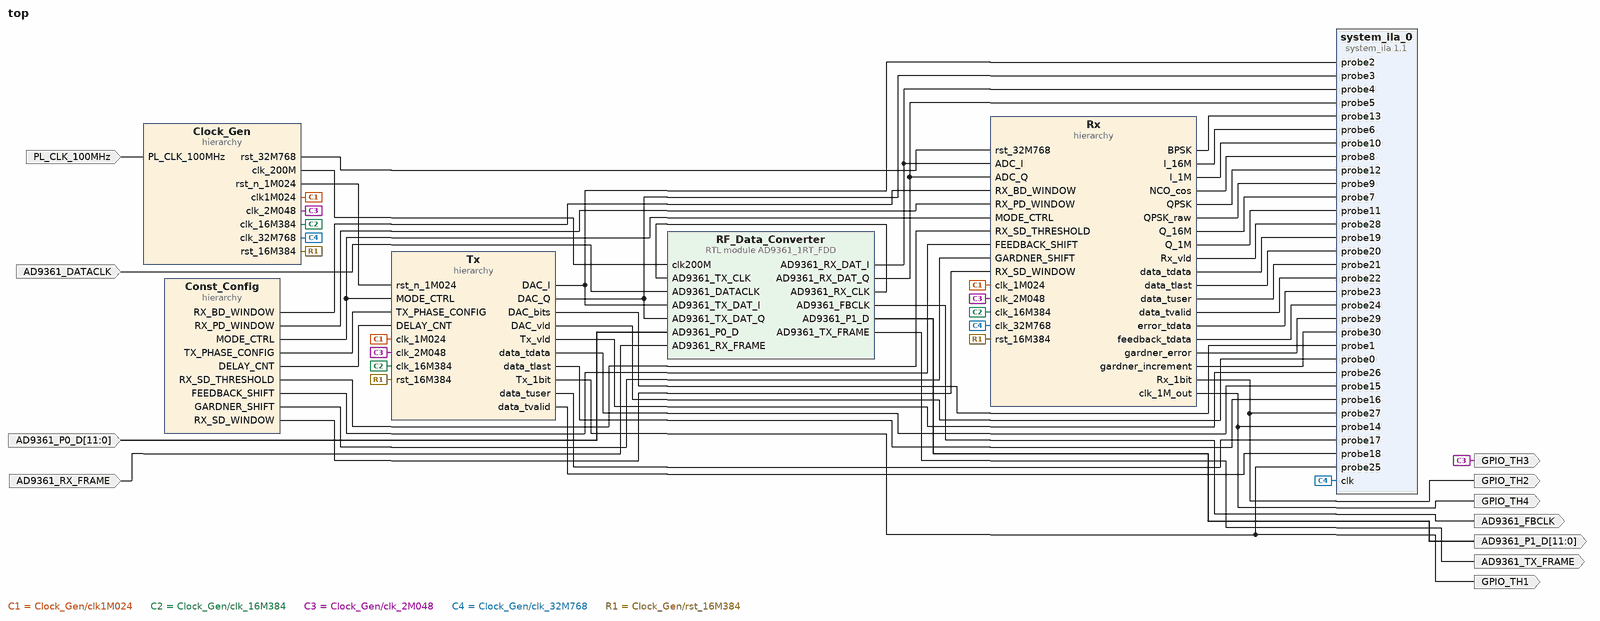
[diagram p0: block diagram of the top level]
# Vivado block design top, xc7z020clg484-1, Vivado 2022.2
create_bd_design top

create_bd_port -dir I -type clk PL_CLK_100MHz
set_property -dict {CONFIG.FREQ_HZ 100000000} [get_bd_ports PL_CLK_100MHz]
create_bd_port -dir O -type data AD9361_TX_FRAME
create_bd_port -dir O -from 11 -to 0 -type data AD9361_P1_D
create_bd_port -dir O -type clk AD9361_FBCLK
create_bd_port -dir I -from 11 -to 0 -type data AD9361_P0_D
create_bd_port -dir I -type clk AD9361_DATACLK
set_property -dict {CONFIG.FREQ_HZ 30720000} [get_bd_ports AD9361_DATACLK]
create_bd_port -dir I -type data AD9361_RX_FRAME
create_bd_port -dir O -type data GPIO_TH1
create_bd_port -dir O -type data GPIO_TH2
create_bd_port -dir O GPIO_TH3
create_bd_port -dir O -type data GPIO_TH4

create_bd_cell -type hier Rx
create_bd_cell -type hier Clock_Gen
create_bd_cell -type hier Tx
create_bd_cell -type ip -vlnv xilinx.com:ip:system_ila:1.1 system_ila_0
set_property -dict [list \
  CONFIG.C_DATA_DEPTH 4096 \
  CONFIG.C_INPUT_PIPE_STAGES 2 \
  CONFIG.C_MON_TYPE NATIVE \
  CONFIG.C_NUM_MONITOR_SLOTS 2 \
  CONFIG.C_NUM_OF_PROBES 31 \
  CONFIG.C_PROBE10_TYPE 0 \
  CONFIG.C_PROBE8_TYPE 0 \
  CONFIG.C_PROBE9_TYPE 0 \
  CONFIG.C_PROBE_WIDTH_PROPAGATION AUTO \
  CONFIG.C_SLOT 0 \
  CONFIG.C_SLOT_0_INTF_TYPE xilinx.com:interface:axis_rtl:1.0 \
  CONFIG.C_SLOT_1_INTF_TYPE xilinx.com:interface:axis_rtl:1.0 \
] [get_bd_cells system_ila_0]
create_bd_cell -type hier Const_Config
create_bd_cell -type module -reference AD9361_1RT_FDD RF_Data_Converter

# ---- hierarchy /Rx ----
current_bd_instance /Rx
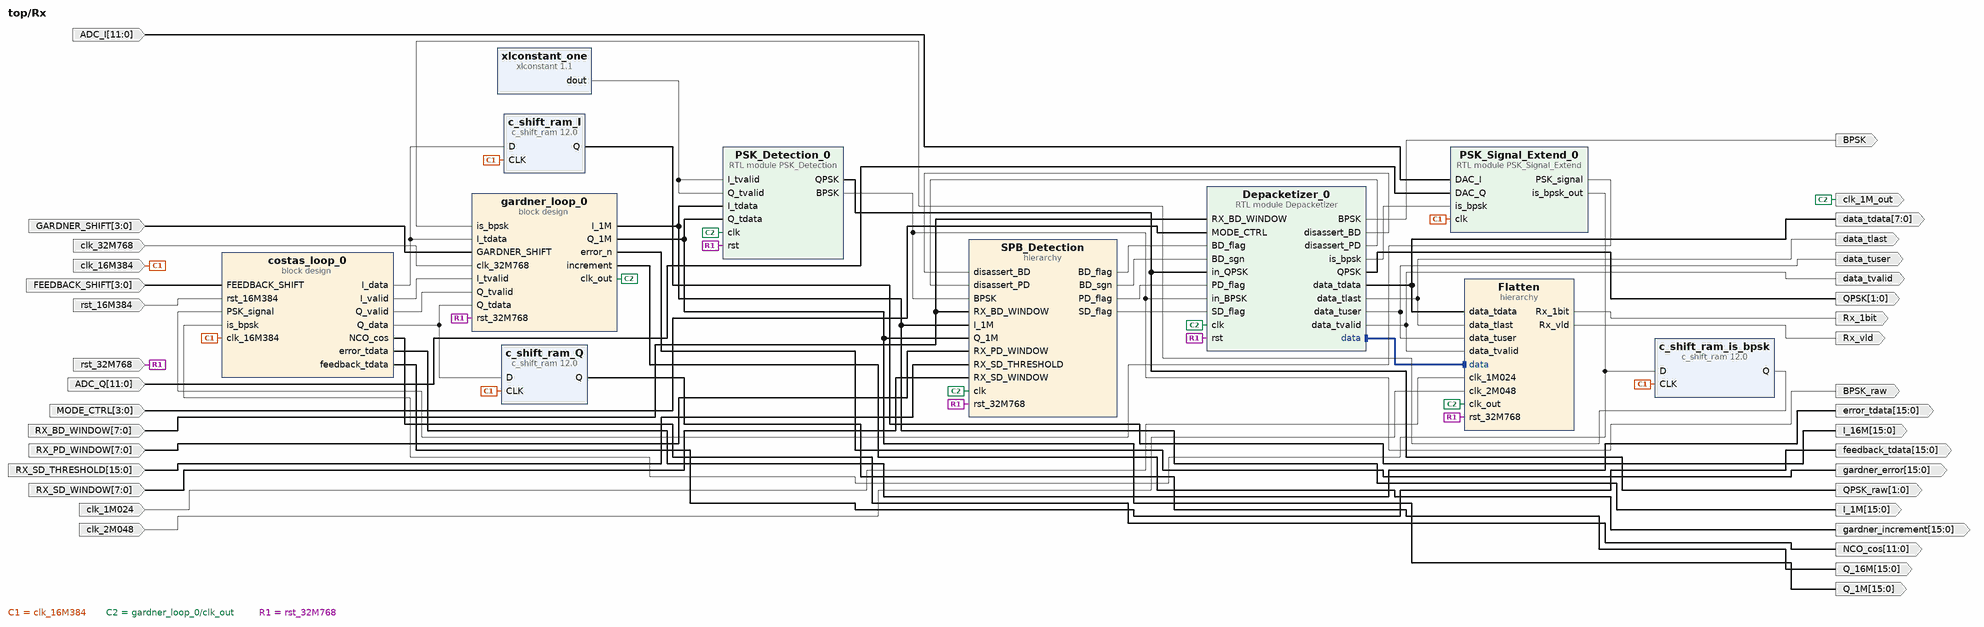
[diagram p1: block diagram inside /Rx]
create_bd_pin -dir I -type clk clk_16M384
create_bd_pin -dir I -from 11 -to 0 ADC_I
create_bd_pin -dir I -from 11 -to 0 ADC_Q
create_bd_pin -dir I -type rst rst_16M384
create_bd_pin -dir O BPSK_raw
create_bd_pin -dir O -from 1 -to 0 QPSK_raw
create_bd_pin -dir O -from 15 -to 0 I_16M
create_bd_pin -dir O -from 15 -to 0 Q_16M
create_bd_pin -dir O -from 11 -to 0 NCO_cos
create_bd_pin -dir I -from 3 -to 0 MODE_CTRL
create_bd_pin -dir I -from 3 -to 0 FEEDBACK_SHIFT
create_bd_pin -dir I clk_32M768
create_bd_pin -dir I rst_32M768
create_bd_pin -dir I -from 3 -to 0 GARDNER_SHIFT
create_bd_pin -dir O -from 15 -to 0 I_1M
create_bd_pin -dir O -from 15 -to 0 Q_1M
create_bd_pin -dir I -from 15 -to 0 RX_SD_THRESHOLD
create_bd_pin -dir I -from 7 -to 0 RX_SD_WINDOW
create_bd_pin -dir I -from 7 -to 0 RX_PD_WINDOW
create_bd_pin -dir I -from 7 -to 0 RX_BD_WINDOW
create_bd_pin -dir O clk_1M_out
create_bd_pin -dir O -from 1 -to 0 QPSK
create_bd_pin -dir O BPSK
create_bd_pin -dir I clk_1M024
create_bd_pin -dir I clk_2M048
create_bd_pin -dir O Rx_1bit
create_bd_pin -dir O -from 7 -to 0 data_tdata
create_bd_pin -dir O data_tlast
create_bd_pin -dir O data_tuser
create_bd_pin -dir O data_tvalid
create_bd_pin -dir O -from 15 -to 0 error_tdata
create_bd_pin -dir O -from 15 -to 0 feedback_tdata
create_bd_pin -dir O Rx_vld
create_bd_pin -dir O -from 15 -to 0 gardner_error
create_bd_pin -dir O -from 15 -to 0 gardner_increment

create_bd_cell -type container -reference costas_loop costas_loop_0
set_property -dict [list \
  CONFIG.ACTIVE_SIM_BD costas_loop.bd \
  CONFIG.ACTIVE_SYNTH_BD costas_loop.bd \
  CONFIG.ENABLE_DFX 0 \
  CONFIG.LIST_SIM_BD costas_loop.bd \
  CONFIG.LIST_SYNTH_BD costas_loop.bd \
  CONFIG.LOCK_PROPAGATE 0 \
] [get_bd_cells costas_loop_0]
create_bd_cell -type ip -vlnv xilinx.com:ip:c_shift_ram:12.0 c_shift_ram_I
set_property -dict {CONFIG.Depth 2} [get_bd_cells c_shift_ram_I]
create_bd_cell -type ip -vlnv xilinx.com:ip:c_shift_ram:12.0 c_shift_ram_Q
set_property -dict {CONFIG.Depth 2} [get_bd_cells c_shift_ram_Q]
create_bd_cell -type container -reference gardner_loop gardner_loop_0
set_property -dict [list \
  CONFIG.ACTIVE_SIM_BD gardner_loop.bd \
  CONFIG.ACTIVE_SYNTH_BD gardner_loop.bd \
  CONFIG.ENABLE_DFX 0 \
  CONFIG.LIST_SIM_BD gardner_loop.bd \
  CONFIG.LIST_SYNTH_BD gardner_loop.bd \
  CONFIG.LOCK_PROPAGATE 0 \
] [get_bd_cells gardner_loop_0]
create_bd_cell -type ip -vlnv xilinx.com:ip:c_shift_ram:12.0 c_shift_ram_is_bpsk
set_property -dict {CONFIG.DefaultData 1 CONFIG.Depth 16 CONFIG.Width 1} [get_bd_cells c_shift_ram_is_bpsk]
create_bd_cell -type ip -vlnv xilinx.com:ip:xlconstant:1.1 xlconstant_one
create_bd_cell -type hier SPB_Detection
create_bd_cell -type hier Flatten
create_bd_cell -type module -reference PSK_Signal_Extend PSK_Signal_Extend_0
set_property -dict {CONFIG.O_WIDTH 12} [get_bd_cells PSK_Signal_Extend_0]
create_bd_cell -type module -reference PSK_Detection PSK_Detection_0
create_bd_cell -type module -reference Depacketizer Depacketizer_0

# ---- hierarchy /Rx/SPB_Detection ----
current_bd_instance /Rx/SPB_Detection
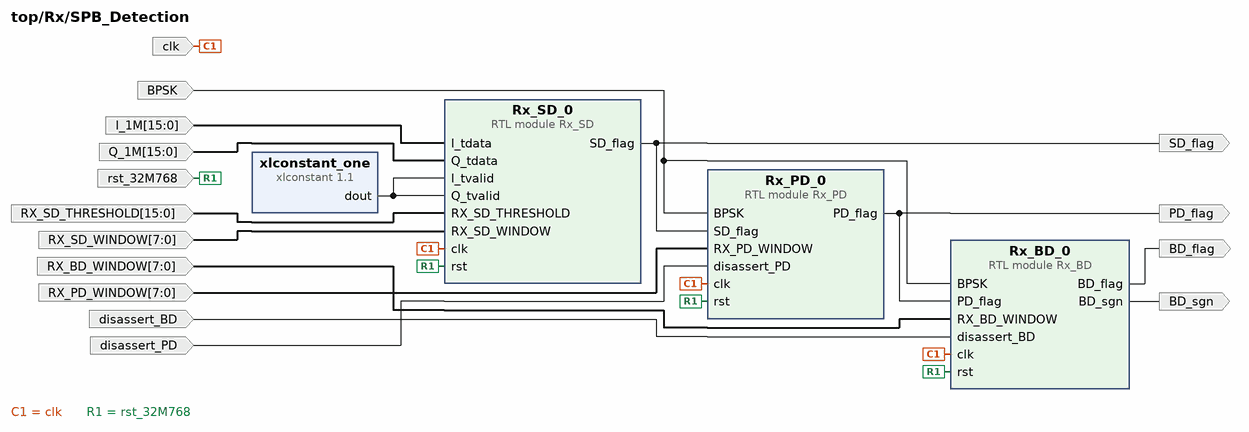
[diagram p2: block diagram inside /Rx/SPB_Detection]
create_bd_pin -dir I -from 15 -to 0 I_1M
create_bd_pin -dir I -from 15 -to 0 Q_1M
create_bd_pin -dir I -type clk clk
create_bd_pin -dir I -type rst rst_32M768
create_bd_pin -dir I -from 15 -to 0 RX_SD_THRESHOLD
create_bd_pin -dir I -from 7 -to 0 RX_SD_WINDOW
create_bd_pin -dir I BPSK
create_bd_pin -dir O SD_flag
create_bd_pin -dir I -from 7 -to 0 RX_PD_WINDOW
create_bd_pin -dir I disassert_PD
create_bd_pin -dir I -from 7 -to 0 RX_BD_WINDOW
create_bd_pin -dir I disassert_BD
create_bd_pin -dir O BD_flag
create_bd_pin -dir O BD_sgn
create_bd_pin -dir O PD_flag

create_bd_cell -type ip -vlnv xilinx.com:ip:xlconstant:1.1 xlconstant_one
create_bd_cell -type module -reference Rx_PD Rx_PD_0
create_bd_cell -type module -reference Rx_SD Rx_SD_0
create_bd_cell -type module -reference Rx_BD Rx_BD_0

# ---- hierarchy /Rx/Flatten ----
current_bd_instance /Rx/Flatten
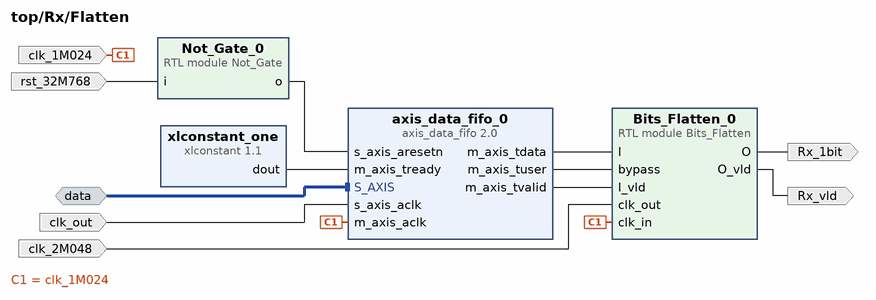
[diagram p3: block diagram inside /Rx/Flatten]
create_bd_intf_pin -mode Slave -vlnv xilinx.com:interface:axis_rtl:1.0 data
create_bd_pin -dir I -type clk clk_1M024
create_bd_pin -dir I rst_32M768
create_bd_pin -dir I clk_out
create_bd_pin -dir I clk_2M048
create_bd_pin -dir O Rx_1bit
create_bd_pin -dir O Rx_vld

create_bd_cell -type ip -vlnv xilinx.com:ip:axis_data_fifo:2.0 axis_data_fifo_0
set_property -dict {CONFIG.FIFO_DEPTH 128 CONFIG.IS_ACLK_ASYNC 1} [get_bd_cells axis_data_fifo_0]
create_bd_cell -type ip -vlnv xilinx.com:ip:xlconstant:1.1 xlconstant_one
create_bd_cell -type module -reference Not_Gate Not_Gate_0
create_bd_cell -type module -reference Bits_Flatten Bits_Flatten_0

# ---- hierarchy /Clock_Gen ----
current_bd_instance /Clock_Gen
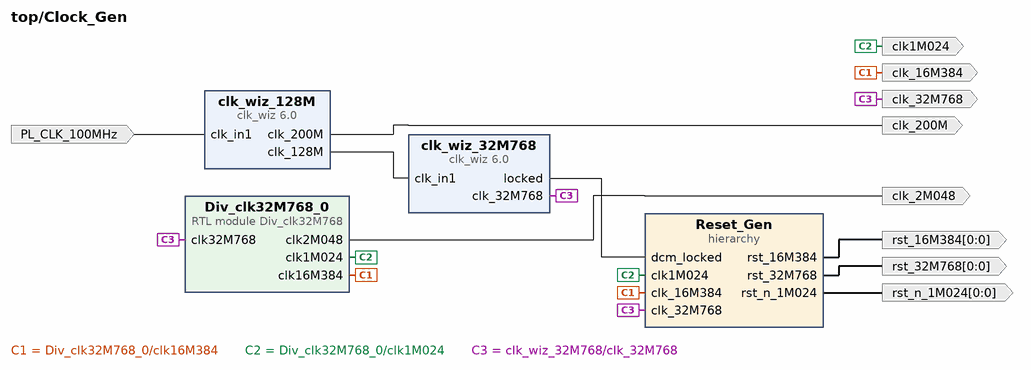
[diagram p4: block diagram inside /Clock_Gen]
create_bd_pin -dir I -type clk PL_CLK_100MHz
create_bd_pin -dir O -type clk clk_200M
create_bd_pin -dir O -type clk clk_16M384
create_bd_pin -dir O -from 0 -to 0 rst_16M384
create_bd_pin -dir O -type clk clk1M024
create_bd_pin -dir O -from 0 -to 0 -type rst rst_n_1M024
create_bd_pin -dir O -from 0 -to 0 rst_32M768
create_bd_pin -dir O -type clk clk_32M768
create_bd_pin -dir O clk_2M048

create_bd_cell -type ip -vlnv xilinx.com:ip:clk_wiz:6.0 clk_wiz_128M
set_property -dict [list \
  CONFIG.CLKOUT1_JITTER 137.542 \
  CONFIG.CLKOUT1_PHASE_ERROR 114.212 \
  CONFIG.CLKOUT1_REQUESTED_OUT_FREQ 128.000 \
  CONFIG.CLKOUT2_JITTER 126.455 \
  CONFIG.CLKOUT2_PHASE_ERROR 114.212 \
  CONFIG.CLKOUT2_REQUESTED_OUT_FREQ 200.000 \
  CONFIG.CLKOUT2_USED true \
  CONFIG.CLKOUT3_JITTER 181.080 \
  CONFIG.CLKOUT3_PHASE_ERROR 114.212 \
  CONFIG.CLKOUT3_REQUESTED_OUT_FREQ 100.000 \
  CONFIG.CLKOUT3_USED false \
  CONFIG.CLK_OUT1_PORT clk_128M \
  CONFIG.CLK_OUT2_PORT clk_200M \
  CONFIG.MMCM_CLKFBOUT_MULT_F 8.000 \
  CONFIG.MMCM_CLKOUT0_DIVIDE_F 6.250 \
  CONFIG.MMCM_CLKOUT1_DIVIDE 4 \
  CONFIG.MMCM_CLKOUT2_DIVIDE 1 \
  CONFIG.MMCM_DIVCLK_DIVIDE 1 \
  CONFIG.NUM_OUT_CLKS 2 \
  CONFIG.USE_LOCKED false \
  CONFIG.USE_RESET false \
] [get_bd_cells clk_wiz_128M]
create_bd_cell -type ip -vlnv xilinx.com:ip:clk_wiz:6.0 clk_wiz_32M768
set_property -dict [list \
  CONFIG.CLKIN1_JITTER_PS 78.12 \
  CONFIG.CLKOUT1_JITTER 154.433 \
  CONFIG.CLKOUT1_PHASE_ERROR 95.333 \
  CONFIG.CLKOUT1_REQUESTED_OUT_FREQ 32.768 \
  CONFIG.CLK_OUT1_PORT clk_32M768 \
  CONFIG.MMCM_CLKFBOUT_MULT_F 8.000 \
  CONFIG.MMCM_CLKIN1_PERIOD 7.813 \
  CONFIG.MMCM_CLKOUT0_DIVIDE_F 31.250 \
  CONFIG.MMCM_DIVCLK_DIVIDE 1 \
  CONFIG.PRIM_IN_FREQ 128.000 \
  CONFIG.USE_LOCKED true \
  CONFIG.USE_RESET false \
] [get_bd_cells clk_wiz_32M768]
create_bd_cell -type hier Reset_Gen
create_bd_cell -type module -reference Div_clk32M768 Div_clk32M768_0

# ---- hierarchy /Clock_Gen/Reset_Gen ----
current_bd_instance /Clock_Gen/Reset_Gen
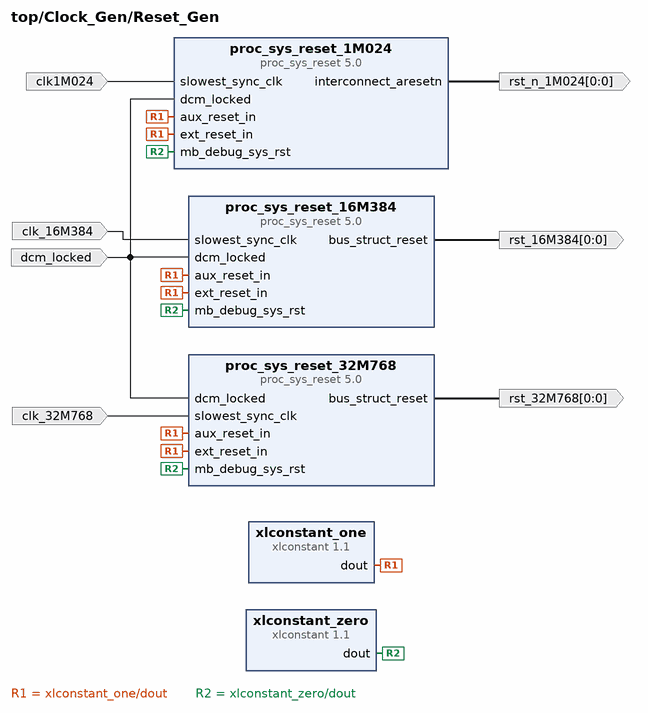
[diagram p5: block diagram inside /Clock_Gen/Reset_Gen]
create_bd_pin -dir I -type clk clk_16M384
create_bd_pin -dir I dcm_locked
create_bd_pin -dir O -from 0 -to 0 -type rst rst_16M384
create_bd_pin -dir O -from 0 -to 0 -type rst rst_n_1M024
create_bd_pin -dir I -type clk clk1M024
create_bd_pin -dir O -from 0 -to 0 rst_32M768
create_bd_pin -dir I -type clk clk_32M768

create_bd_cell -type ip -vlnv xilinx.com:ip:xlconstant:1.1 xlconstant_zero
set_property -dict {CONFIG.CONST_VAL 0} [get_bd_cells xlconstant_zero]
create_bd_cell -type ip -vlnv xilinx.com:ip:xlconstant:1.1 xlconstant_one
create_bd_cell -type ip -vlnv xilinx.com:ip:proc_sys_reset:5.0 proc_sys_reset_16M384
create_bd_cell -type ip -vlnv xilinx.com:ip:proc_sys_reset:5.0 proc_sys_reset_1M024
create_bd_cell -type ip -vlnv xilinx.com:ip:proc_sys_reset:5.0 proc_sys_reset_32M768

# ---- hierarchy /Tx ----
current_bd_instance /Tx
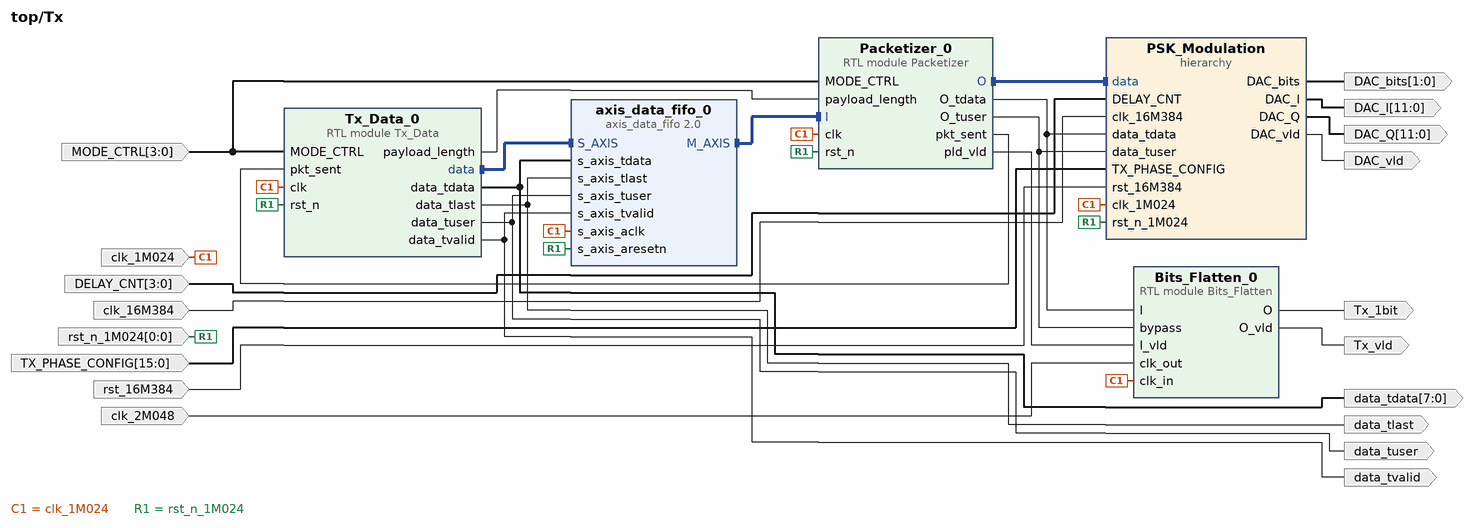
[diagram p6: block diagram inside /Tx]
create_bd_pin -dir I -type clk clk_16M384
create_bd_pin -dir I rst_16M384
create_bd_pin -dir O -from 11 -to 0 DAC_I
create_bd_pin -dir O -from 11 -to 0 DAC_Q
create_bd_pin -dir I -type clk clk_1M024
create_bd_pin -dir O DAC_vld
create_bd_pin -dir O -from 1 -to 0 DAC_bits
create_bd_pin -dir I -from 3 -to 0 DELAY_CNT
create_bd_pin -dir I -from 3 -to 0 MODE_CTRL
create_bd_pin -dir I clk_2M048
create_bd_pin -dir O Tx_1bit
create_bd_pin -dir I -from 0 -to 0 -type rst rst_n_1M024
create_bd_pin -dir I -from 15 -to 0 TX_PHASE_CONFIG
create_bd_pin -dir O -from 7 -to 0 data_tdata
create_bd_pin -dir O data_tlast
create_bd_pin -dir O data_tuser
create_bd_pin -dir O data_tvalid
create_bd_pin -dir O Tx_vld

create_bd_cell -type hier PSK_Modulation
create_bd_cell -type ip -vlnv xilinx.com:ip:axis_data_fifo:2.0 axis_data_fifo_0
create_bd_cell -type module -reference Tx_Data Tx_Data_0
create_bd_cell -type module -reference Packetizer Packetizer_0
create_bd_cell -type module -reference Bits_Flatten Bits_Flatten_0

# ---- hierarchy /Tx/PSK_Modulation ----
current_bd_instance /Tx/PSK_Modulation
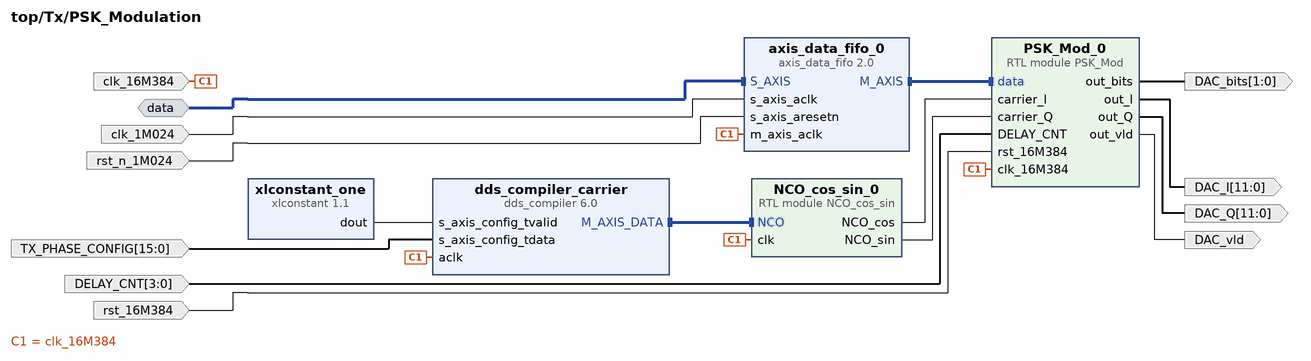
[diagram p7: block diagram inside /Tx/PSK_Modulation]
create_bd_intf_pin -mode Slave -vlnv xilinx.com:interface:axis_rtl:1.0 data
create_bd_pin -dir I -type clk clk_16M384
create_bd_pin -dir I rst_16M384
create_bd_pin -dir O -from 11 -to 0 DAC_I
create_bd_pin -dir O -from 11 -to 0 DAC_Q
create_bd_pin -dir I -type clk clk_1M024
create_bd_pin -dir I -type rst rst_n_1M024
create_bd_pin -dir O DAC_vld
create_bd_pin -dir O -from 1 -to 0 DAC_bits
create_bd_pin -dir I -from 3 -to 0 DELAY_CNT
create_bd_pin -dir I -from 15 -to 0 TX_PHASE_CONFIG

create_bd_cell -type ip -vlnv xilinx.com:ip:dds_compiler:6.0 dds_compiler_carrier
set_property -dict [list \
  CONFIG.DATA_Has_TLAST Not_Required \
  CONFIG.DDS_Clock_Rate 16.384 \
  CONFIG.Frequency_Resolution 512 \
  CONFIG.Has_ARESETn false \
  CONFIG.Has_Phase_Out false \
  CONFIG.Latency 7 \
  CONFIG.M_DATA_Has_TUSER Not_Required \
  CONFIG.Noise_Shaping Auto \
  CONFIG.Output_Frequency1 4.096 \
  CONFIG.Output_Width 12 \
  CONFIG.PINC1 10000000000000 \
  CONFIG.Parameter_Entry System_Parameters \
  CONFIG.PartsPresent Phase_Generator_and_SIN_COS_LUT \
  CONFIG.Phase_Increment Programmable \
  CONFIG.Phase_Width 15 \
  CONFIG.S_PHASE_Has_TUSER Not_Required \
  CONFIG.Spurious_Free_Dynamic_Range 72 \
] [get_bd_cells dds_compiler_carrier]
create_bd_cell -type ip -vlnv xilinx.com:ip:axis_data_fifo:2.0 axis_data_fifo_0
set_property -dict {CONFIG.FIFO_DEPTH 16 CONFIG.IS_ACLK_ASYNC 1 CONFIG.TUSER_WIDTH 1} [get_bd_cells axis_data_fifo_0]
create_bd_cell -type ip -vlnv xilinx.com:ip:xlconstant:1.1 xlconstant_one
create_bd_cell -type module -reference NCO_cos_sin NCO_cos_sin_0
set_property -dict {CONFIG.O_WIDTH 12} [get_bd_cells NCO_cos_sin_0]
create_bd_cell -type module -reference PSK_Mod PSK_Mod_0

# ---- hierarchy /Const_Config ----
current_bd_instance /Const_Config
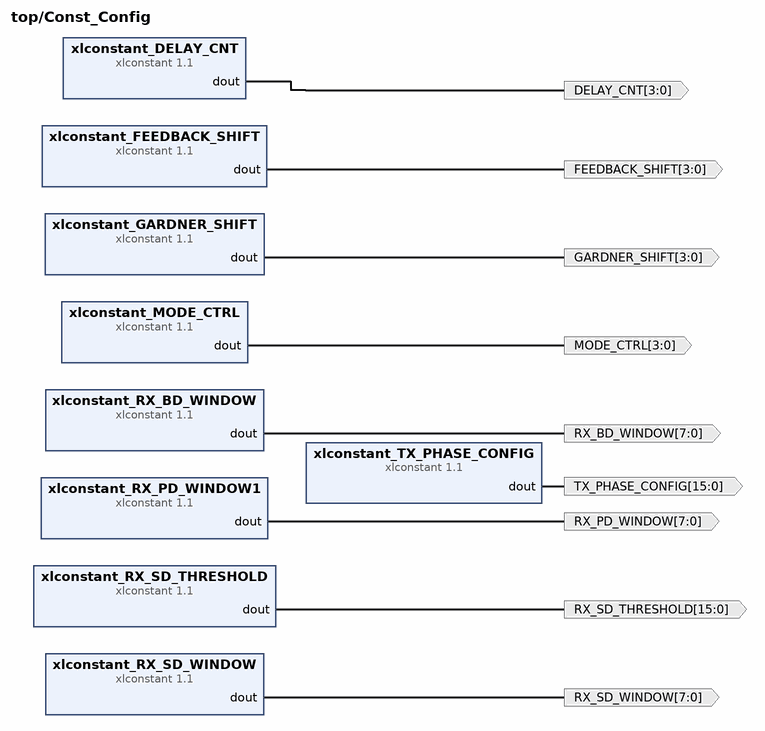
[diagram p8: block diagram inside /Const_Config]
create_bd_pin -dir O -from 3 -to 0 DELAY_CNT
create_bd_pin -dir O -from 3 -to 0 MODE_CTRL
create_bd_pin -dir O -from 3 -to 0 FEEDBACK_SHIFT
create_bd_pin -dir O -from 3 -to 0 GARDNER_SHIFT
create_bd_pin -dir O -from 15 -to 0 RX_SD_THRESHOLD
create_bd_pin -dir O -from 7 -to 0 RX_SD_WINDOW
create_bd_pin -dir O -from 7 -to 0 RX_PD_WINDOW
create_bd_pin -dir O -from 7 -to 0 RX_BD_WINDOW
create_bd_pin -dir O -from 15 -to 0 TX_PHASE_CONFIG

create_bd_cell -type ip -vlnv xilinx.com:ip:xlconstant:1.1 xlconstant_DELAY_CNT
set_property -dict {CONFIG.CONST_VAL 8 CONFIG.CONST_WIDTH 4} [get_bd_cells xlconstant_DELAY_CNT]
create_bd_cell -type ip -vlnv xilinx.com:ip:xlconstant:1.1 xlconstant_FEEDBACK_SHIFT
set_property -dict {CONFIG.CONST_VAL 0 CONFIG.CONST_WIDTH 4} [get_bd_cells xlconstant_FEEDBACK_SHIFT]
create_bd_cell -type ip -vlnv xilinx.com:ip:xlconstant:1.1 xlconstant_MODE_CTRL
set_property -dict {CONFIG.CONST_VAL 4 CONFIG.CONST_WIDTH 4} [get_bd_cells xlconstant_MODE_CTRL]
create_bd_cell -type ip -vlnv xilinx.com:ip:xlconstant:1.1 xlconstant_GARDNER_SHIFT
set_property -dict {CONFIG.CONST_VAL 3 CONFIG.CONST_WIDTH 4} [get_bd_cells xlconstant_GARDNER_SHIFT]
create_bd_cell -type ip -vlnv xilinx.com:ip:xlconstant:1.1 xlconstant_RX_SD_THRESHOLD
set_property -dict {CONFIG.CONST_VAL 128 CONFIG.CONST_WIDTH 16} [get_bd_cells xlconstant_RX_SD_THRESHOLD]
create_bd_cell -type ip -vlnv xilinx.com:ip:xlconstant:1.1 xlconstant_RX_SD_WINDOW
set_property -dict {CONFIG.CONST_VAL 16 CONFIG.CONST_WIDTH 8} [get_bd_cells xlconstant_RX_SD_WINDOW]
create_bd_cell -type ip -vlnv xilinx.com:ip:xlconstant:1.1 xlconstant_RX_PD_WINDOW1
set_property -dict {CONFIG.CONST_VAL 16 CONFIG.CONST_WIDTH 8} [get_bd_cells xlconstant_RX_PD_WINDOW1]
create_bd_cell -type ip -vlnv xilinx.com:ip:xlconstant:1.1 xlconstant_RX_BD_WINDOW
set_property -dict {CONFIG.CONST_VAL 16 CONFIG.CONST_WIDTH 8} [get_bd_cells xlconstant_RX_BD_WINDOW]
create_bd_cell -type ip -vlnv xilinx.com:ip:xlconstant:1.1 xlconstant_TX_PHASE_CONFIG
set_property -dict {CONFIG.CONST_VAL 8192 CONFIG.CONST_WIDTH 16} [get_bd_cells xlconstant_TX_PHASE_CONFIG]

# ---- connections ----

current_bd_instance /Rx
connect_bd_intf_net [get_bd_intf_pins Depacketizer_0/data] [get_bd_intf_pins Flatten/data]
connect_bd_net -net AD9361_1RT_FDD_0_AD9361_RX_DAT_I [get_bd_pins ADC_I] [get_bd_pins PSK_Signal_Extend_0/DAC_I]
connect_bd_net -net AD9361_1RT_FDD_0_AD9361_RX_DAT_Q [get_bd_pins ADC_Q] [get_bd_pins PSK_Signal_Extend_0/DAC_Q]
connect_bd_net [get_bd_pins Depacketizer_0/BPSK] [get_bd_pins BPSK]
connect_bd_net [get_bd_pins Depacketizer_0/QPSK] [get_bd_pins QPSK]
connect_bd_net [get_bd_pins Depacketizer_0/data_tdata] [get_bd_pins Flatten/data_tdata] [get_bd_pins data_tdata]
connect_bd_net [get_bd_pins Depacketizer_0/data_tlast] [get_bd_pins Flatten/data_tlast] [get_bd_pins data_tlast]
connect_bd_net [get_bd_pins Depacketizer_0/data_tuser] [get_bd_pins Flatten/data_tuser] [get_bd_pins data_tuser]
connect_bd_net [get_bd_pins Depacketizer_0/data_tvalid] [get_bd_pins Flatten/data_tvalid] [get_bd_pins data_tvalid]
connect_bd_net [get_bd_pins Depacketizer_0/disassert_BD] [get_bd_pins SPB_Detection/disassert_BD]
connect_bd_net [get_bd_pins Depacketizer_0/disassert_PD] [get_bd_pins SPB_Detection/disassert_PD]
connect_bd_net [get_bd_pins Depacketizer_0/is_bpsk] [get_bd_pins PSK_Signal_Extend_0/is_bpsk]
connect_bd_net -net Div_clk32M768_0_clk16M384 [get_bd_pins clk_16M384] \
  [get_bd_pins costas_loop_0/clk_16M384] [get_bd_pins c_shift_ram_I/CLK] [get_bd_pins c_shift_ram_Q/CLK] \
  [get_bd_pins c_shift_ram_is_bpsk/CLK] [get_bd_pins PSK_Signal_Extend_0/clk]
connect_bd_net [get_bd_pins FEEDBACK_SHIFT] [get_bd_pins costas_loop_0/FEEDBACK_SHIFT]
connect_bd_net [get_bd_pins Flatten/Rx_1bit] [get_bd_pins Rx_1bit]
connect_bd_net [get_bd_pins Flatten/Rx_vld] [get_bd_pins Rx_vld]
connect_bd_net [get_bd_pins GARDNER_SHIFT] [get_bd_pins gardner_loop_0/GARDNER_SHIFT]
connect_bd_net -net I_tvalid_1 [get_bd_pins costas_loop_0/I_valid] [get_bd_pins gardner_loop_0/I_tvalid]
connect_bd_net [get_bd_pins MODE_CTRL] [get_bd_pins Depacketizer_0/MODE_CTRL]
connect_bd_net [get_bd_pins PSK_Detection_0/BPSK] [get_bd_pins BPSK_raw] [get_bd_pins SPB_Detection/BPSK] [get_bd_pins Depacketizer_0/in_BPSK]
connect_bd_net [get_bd_pins PSK_Detection_0/QPSK] [get_bd_pins QPSK_raw] [get_bd_pins Depacketizer_0/in_QPSK]
connect_bd_net [get_bd_pins PSK_Signal_Extend_0/PSK_signal] [get_bd_pins costas_loop_0/PSK_signal]
connect_bd_net [get_bd_pins PSK_Signal_Extend_0/is_bpsk_out] [get_bd_pins costas_loop_0/is_bpsk] [get_bd_pins c_shift_ram_is_bpsk/D]
connect_bd_net -net Q_tvalid_2 [get_bd_pins costas_loop_0/Q_valid] [get_bd_pins gardner_loop_0/Q_tvalid]
connect_bd_net [get_bd_pins RX_BD_WINDOW] [get_bd_pins SPB_Detection/RX_BD_WINDOW] [get_bd_pins Depacketizer_0/RX_BD_WINDOW]
connect_bd_net [get_bd_pins RX_PD_WINDOW] [get_bd_pins SPB_Detection/RX_PD_WINDOW]
connect_bd_net [get_bd_pins RX_SD_THRESHOLD] [get_bd_pins SPB_Detection/RX_SD_THRESHOLD]
connect_bd_net [get_bd_pins RX_SD_WINDOW] [get_bd_pins SPB_Detection/RX_SD_WINDOW]
connect_bd_net [get_bd_pins SPB_Detection/BD_flag] [get_bd_pins Depacketizer_0/BD_flag]
connect_bd_net [get_bd_pins SPB_Detection/BD_sgn] [get_bd_pins Depacketizer_0/BD_sgn]
connect_bd_net [get_bd_pins SPB_Detection/PD_flag] [get_bd_pins Depacketizer_0/PD_flag]
connect_bd_net [get_bd_pins SPB_Detection/SD_flag] [get_bd_pins Depacketizer_0/SD_flag]
connect_bd_net [get_bd_pins c_shift_ram_I/Q] [get_bd_pins I_16M]
connect_bd_net [get_bd_pins c_shift_ram_Q/Q] [get_bd_pins Q_16M]
connect_bd_net [get_bd_pins c_shift_ram_is_bpsk/Q] [get_bd_pins gardner_loop_0/is_bpsk]
connect_bd_net -net clk_1M024_1 [get_bd_pins clk_1M024] [get_bd_pins Flatten/clk_1M024]
connect_bd_net -net clk_2M048_1 [get_bd_pins clk_2M048] [get_bd_pins Flatten/clk_2M048]
connect_bd_net -net clk_32M768_1 [get_bd_pins clk_32M768] [get_bd_pins gardner_loop_0/clk_32M768]
connect_bd_net -net costas_loop_0_I1_tdata [get_bd_pins costas_loop_0/I_data] [get_bd_pins gardner_loop_0/I_tdata] [get_bd_pins c_shift_ram_I/D]
connect_bd_net [get_bd_pins costas_loop_0/NCO_cos] [get_bd_pins NCO_cos]
connect_bd_net -net costas_loop_0_Q1_tdata [get_bd_pins costas_loop_0/Q_data] [get_bd_pins gardner_loop_0/Q_tdata] [get_bd_pins c_shift_ram_Q/D]
connect_bd_net [get_bd_pins costas_loop_0/error_tdata] [get_bd_pins error_tdata]
connect_bd_net [get_bd_pins costas_loop_0/feedback_tdata] [get_bd_pins feedback_tdata]
connect_bd_net [get_bd_pins gardner_loop_0/I_1M] [get_bd_pins I_1M] [get_bd_pins SPB_Detection/I_1M] [get_bd_pins PSK_Detection_0/I_tdata]
connect_bd_net [get_bd_pins gardner_loop_0/Q_1M] [get_bd_pins Q_1M] [get_bd_pins SPB_Detection/Q_1M] [get_bd_pins PSK_Detection_0/Q_tdata]
connect_bd_net [get_bd_pins gardner_loop_0/clk_out] \
  [get_bd_pins SPB_Detection/clk] [get_bd_pins clk_1M_out] [get_bd_pins Flatten/clk_out] [get_bd_pins PSK_Detection_0/clk] \
  [get_bd_pins Depacketizer_0/clk]
connect_bd_net [get_bd_pins gardner_loop_0/error_n] [get_bd_pins gardner_error]
connect_bd_net [get_bd_pins gardner_loop_0/increment] [get_bd_pins gardner_increment]
connect_bd_net -net rst_16M386_1 [get_bd_pins rst_16M384] [get_bd_pins costas_loop_0/rst_16M384]
connect_bd_net -net rst_32M768_1 [get_bd_pins rst_32M768] \
  [get_bd_pins gardner_loop_0/rst_32M768] [get_bd_pins SPB_Detection/rst_32M768] [get_bd_pins Flatten/rst_32M768] \
  [get_bd_pins PSK_Detection_0/rst] [get_bd_pins Depacketizer_0/rst]
connect_bd_net [get_bd_pins xlconstant_one/dout] [get_bd_pins PSK_Detection_0/I_tvalid] [get_bd_pins PSK_Detection_0/Q_tvalid]

current_bd_instance /Rx/SPB_Detection
connect_bd_net [get_bd_pins BPSK] [get_bd_pins Rx_PD_0/BPSK] [get_bd_pins Rx_BD_0/BPSK]
connect_bd_net [get_bd_pins I_1M] [get_bd_pins Rx_SD_0/I_tdata]
connect_bd_net [get_bd_pins Q_1M] [get_bd_pins Rx_SD_0/Q_tdata]
connect_bd_net [get_bd_pins RX_BD_WINDOW] [get_bd_pins Rx_BD_0/RX_BD_WINDOW]
connect_bd_net [get_bd_pins RX_PD_WINDOW] [get_bd_pins Rx_PD_0/RX_PD_WINDOW]
connect_bd_net [get_bd_pins RX_SD_THRESHOLD] [get_bd_pins Rx_SD_0/RX_SD_THRESHOLD]
connect_bd_net [get_bd_pins RX_SD_WINDOW] [get_bd_pins Rx_SD_0/RX_SD_WINDOW]
connect_bd_net [get_bd_pins Rx_BD_0/BD_flag] [get_bd_pins BD_flag]
connect_bd_net [get_bd_pins Rx_BD_0/BD_sgn] [get_bd_pins BD_sgn]
connect_bd_net [get_bd_pins Rx_PD_0/PD_flag] [get_bd_pins PD_flag] [get_bd_pins Rx_BD_0/PD_flag]
connect_bd_net [get_bd_pins Rx_SD_0/SD_flag] [get_bd_pins SD_flag] [get_bd_pins Rx_PD_0/SD_flag]
connect_bd_net [get_bd_pins clk] [get_bd_pins Rx_PD_0/clk] [get_bd_pins Rx_SD_0/clk] [get_bd_pins Rx_BD_0/clk]
connect_bd_net [get_bd_pins disassert_BD] [get_bd_pins Rx_BD_0/disassert_BD]
connect_bd_net [get_bd_pins disassert_PD] [get_bd_pins Rx_PD_0/disassert_PD]
connect_bd_net -net rst_32M768_1 [get_bd_pins rst_32M768] [get_bd_pins Rx_PD_0/rst] [get_bd_pins Rx_SD_0/rst] [get_bd_pins Rx_BD_0/rst]
connect_bd_net [get_bd_pins xlconstant_one/dout] [get_bd_pins Rx_SD_0/I_tvalid] [get_bd_pins Rx_SD_0/Q_tvalid]

current_bd_instance /Rx/Flatten
connect_bd_intf_net [get_bd_intf_pins data] [get_bd_intf_pins axis_data_fifo_0/S_AXIS]
connect_bd_net [get_bd_pins Bits_Flatten_0/O] [get_bd_pins Rx_1bit]
connect_bd_net [get_bd_pins Bits_Flatten_0/O_vld] [get_bd_pins Rx_vld]
connect_bd_net [get_bd_pins Not_Gate_0/o] [get_bd_pins axis_data_fifo_0/s_axis_aresetn]
connect_bd_net [get_bd_pins axis_data_fifo_0/m_axis_tdata] [get_bd_pins Bits_Flatten_0/I]
connect_bd_net [get_bd_pins axis_data_fifo_0/m_axis_tuser] [get_bd_pins Bits_Flatten_0/bypass]
connect_bd_net [get_bd_pins axis_data_fifo_0/m_axis_tvalid] [get_bd_pins Bits_Flatten_0/I_vld]
connect_bd_net -net clk_1M024_1 [get_bd_pins clk_1M024] [get_bd_pins axis_data_fifo_0/m_axis_aclk] [get_bd_pins Bits_Flatten_0/clk_in]
connect_bd_net -net clk_2M048_1 [get_bd_pins clk_2M048] [get_bd_pins Bits_Flatten_0/clk_out]
connect_bd_net [get_bd_pins clk_out] [get_bd_pins axis_data_fifo_0/s_axis_aclk]
connect_bd_net -net rst_32M768_1 [get_bd_pins rst_32M768] [get_bd_pins Not_Gate_0/i]
connect_bd_net [get_bd_pins xlconstant_one/dout] [get_bd_pins axis_data_fifo_0/m_axis_tready]

current_bd_instance /Clock_Gen
connect_bd_net [get_bd_pins Div_clk32M768_0/clk16M384] [get_bd_pins clk_16M384] [get_bd_pins Reset_Gen/clk_16M384]
connect_bd_net [get_bd_pins Div_clk32M768_0/clk1M024] [get_bd_pins clk1M024] [get_bd_pins Reset_Gen/clk1M024]
connect_bd_net [get_bd_pins Div_clk32M768_0/clk2M048] [get_bd_pins clk_2M048]
connect_bd_net [get_bd_pins PL_CLK_100MHz] [get_bd_pins clk_wiz_128M/clk_in1]
connect_bd_net [get_bd_pins Reset_Gen/rst_16M384] [get_bd_pins rst_16M384]
connect_bd_net [get_bd_pins Reset_Gen/rst_32M768] [get_bd_pins rst_32M768]
connect_bd_net [get_bd_pins clk_wiz_128M/clk_128M] [get_bd_pins clk_wiz_32M768/clk_in1]
connect_bd_net [get_bd_pins clk_wiz_128M/clk_200M] [get_bd_pins clk_200M]
connect_bd_net [get_bd_pins clk_wiz_32M768/clk_32M768] \
  [get_bd_pins Reset_Gen/clk_32M768] [get_bd_pins clk_32M768] [get_bd_pins Div_clk32M768_0/clk32M768]
connect_bd_net [get_bd_pins clk_wiz_32M768/locked] [get_bd_pins Reset_Gen/dcm_locked]
connect_bd_net -net rst_n_1M024 [get_bd_pins Reset_Gen/rst_n_1M024] [get_bd_pins rst_n_1M024]

current_bd_instance /Clock_Gen/Reset_Gen
connect_bd_net -net Div_clk32M768_0_clk16M384 [get_bd_pins clk_16M384] [get_bd_pins proc_sys_reset_16M384/slowest_sync_clk]
connect_bd_net -net clk1M024_1 [get_bd_pins clk1M024] [get_bd_pins proc_sys_reset_1M024/slowest_sync_clk]
connect_bd_net -net clk_wiz_32M768_locked [get_bd_pins dcm_locked] \
  [get_bd_pins proc_sys_reset_16M384/dcm_locked] [get_bd_pins proc_sys_reset_1M024/dcm_locked] \
  [get_bd_pins proc_sys_reset_32M768/dcm_locked]
connect_bd_net [get_bd_pins proc_sys_reset_16M384/bus_struct_reset] [get_bd_pins rst_16M384]
connect_bd_net [get_bd_pins proc_sys_reset_1M024/interconnect_aresetn] [get_bd_pins rst_n_1M024]
connect_bd_net [get_bd_pins proc_sys_reset_32M768/bus_struct_reset] [get_bd_pins rst_32M768]
connect_bd_net -net slowest_sync_clk_1 [get_bd_pins clk_32M768] [get_bd_pins proc_sys_reset_32M768/slowest_sync_clk]
connect_bd_net [get_bd_pins xlconstant_one/dout] \
  [get_bd_pins proc_sys_reset_16M384/ext_reset_in] [get_bd_pins proc_sys_reset_16M384/aux_reset_in] \
  [get_bd_pins proc_sys_reset_1M024/ext_reset_in] [get_bd_pins proc_sys_reset_1M024/aux_reset_in] \
  [get_bd_pins proc_sys_reset_32M768/ext_reset_in] [get_bd_pins proc_sys_reset_32M768/aux_reset_in]
connect_bd_net [get_bd_pins xlconstant_zero/dout] \
  [get_bd_pins proc_sys_reset_16M384/mb_debug_sys_rst] [get_bd_pins proc_sys_reset_1M024/mb_debug_sys_rst] \
  [get_bd_pins proc_sys_reset_32M768/mb_debug_sys_rst]

current_bd_instance /Tx
connect_bd_intf_net [get_bd_intf_pins Tx_Data_0/data] [get_bd_intf_pins axis_data_fifo_0/S_AXIS]
connect_bd_intf_net [get_bd_intf_pins axis_data_fifo_0/M_AXIS] [get_bd_intf_pins Packetizer_0/I]
connect_bd_intf_net [get_bd_intf_pins PSK_Modulation/data] [get_bd_intf_pins Packetizer_0/O]
connect_bd_net [get_bd_pins Bits_Flatten_0/O_vld] [get_bd_pins Tx_vld]
connect_bd_net -net Bits_Flatten_0_out [get_bd_pins Bits_Flatten_0/O] [get_bd_pins Tx_1bit]
connect_bd_net [get_bd_pins DELAY_CNT] [get_bd_pins PSK_Modulation/DELAY_CNT]
connect_bd_net -net Div_clk32M768_0_clk16M384 [get_bd_pins clk_16M384] [get_bd_pins PSK_Modulation/clk_16M384]
connect_bd_net [get_bd_pins MODE_CTRL] [get_bd_pins Tx_Data_0/MODE_CTRL] [get_bd_pins Packetizer_0/MODE_CTRL]
connect_bd_net -net PSK_Mod_0_out_I [get_bd_pins PSK_Modulation/DAC_I] [get_bd_pins DAC_I]
connect_bd_net -net PSK_Mod_0_out_Q [get_bd_pins PSK_Modulation/DAC_Q] [get_bd_pins DAC_Q]
connect_bd_net -net PSK_Modulation_out_bits [get_bd_pins PSK_Modulation/DAC_bits] [get_bd_pins DAC_bits]
connect_bd_net -net PSK_Modulation_out_vld [get_bd_pins PSK_Modulation/DAC_vld] [get_bd_pins DAC_vld]
connect_bd_net -net Packetizer_0_out_tdata [get_bd_pins Packetizer_0/O_tdata] [get_bd_pins PSK_Modulation/data_tdata] [get_bd_pins Bits_Flatten_0/I]
connect_bd_net -net Packetizer_0_out_tuser [get_bd_pins Packetizer_0/O_tuser] \
  [get_bd_pins PSK_Modulation/data_tuser] [get_bd_pins Bits_Flatten_0/bypass]
connect_bd_net [get_bd_pins Packetizer_0/pkt_sent] [get_bd_pins Tx_Data_0/pkt_sent]
connect_bd_net [get_bd_pins Packetizer_0/pld_vld] [get_bd_pins Bits_Flatten_0/I_vld]
connect_bd_net [get_bd_pins TX_PHASE_CONFIG] [get_bd_pins PSK_Modulation/TX_PHASE_CONFIG]
connect_bd_net [get_bd_pins Tx_Data_0/data_tdata] [get_bd_pins data_tdata] [get_bd_pins axis_data_fifo_0/s_axis_tdata]
connect_bd_net [get_bd_pins Tx_Data_0/data_tlast] [get_bd_pins data_tlast] [get_bd_pins axis_data_fifo_0/s_axis_tlast]
connect_bd_net [get_bd_pins Tx_Data_0/data_tuser] [get_bd_pins data_tuser] [get_bd_pins axis_data_fifo_0/s_axis_tuser]
connect_bd_net [get_bd_pins Tx_Data_0/data_tvalid] [get_bd_pins data_tvalid] [get_bd_pins axis_data_fifo_0/s_axis_tvalid]
connect_bd_net [get_bd_pins Tx_Data_0/payload_length] [get_bd_pins Packetizer_0/payload_length]
connect_bd_net [get_bd_pins clk_1M024] \
  [get_bd_pins PSK_Modulation/clk_1M024] [get_bd_pins axis_data_fifo_0/s_axis_aclk] [get_bd_pins Tx_Data_0/clk] \
  [get_bd_pins Packetizer_0/clk] [get_bd_pins Bits_Flatten_0/clk_in]
connect_bd_net -net clk_2M048_1 [get_bd_pins clk_2M048] [get_bd_pins Bits_Flatten_0/clk_out]
connect_bd_net -net proc_sys_reset_16M384_mb_reset [get_bd_pins rst_16M384] [get_bd_pins PSK_Modulation/rst_16M384]
connect_bd_net -net s_axis_aresetn_1 [get_bd_pins rst_n_1M024] \
  [get_bd_pins PSK_Modulation/rst_n_1M024] [get_bd_pins axis_data_fifo_0/s_axis_aresetn] [get_bd_pins Tx_Data_0/rst_n] \
  [get_bd_pins Packetizer_0/rst_n]

current_bd_instance /Tx/PSK_Modulation
connect_bd_intf_net [get_bd_intf_pins axis_data_fifo_0/M_AXIS] [get_bd_intf_pins PSK_Mod_0/data]
connect_bd_intf_net [get_bd_intf_pins data] [get_bd_intf_pins axis_data_fifo_0/S_AXIS]
connect_bd_intf_net -intf_net dds_compiler_0_M_AXIS_DATA [get_bd_intf_pins dds_compiler_carrier/M_AXIS_DATA] [get_bd_intf_pins NCO_cos_sin_0/NCO]
connect_bd_net [get_bd_pins DELAY_CNT] [get_bd_pins PSK_Mod_0/DELAY_CNT]
connect_bd_net -net Div_clk32M768_0_clk16M384 [get_bd_pins clk_16M384] \
  [get_bd_pins dds_compiler_carrier/aclk] [get_bd_pins axis_data_fifo_0/m_axis_aclk] [get_bd_pins NCO_cos_sin_0/clk] \
  [get_bd_pins PSK_Mod_0/clk_16M384]
connect_bd_net [get_bd_pins NCO_cos_sin_0/NCO_cos] [get_bd_pins PSK_Mod_0/carrier_I]
connect_bd_net [get_bd_pins NCO_cos_sin_0/NCO_sin] [get_bd_pins PSK_Mod_0/carrier_Q]
connect_bd_net [get_bd_pins PSK_Mod_0/out_I] [get_bd_pins DAC_I]
connect_bd_net [get_bd_pins PSK_Mod_0/out_Q] [get_bd_pins DAC_Q]
connect_bd_net [get_bd_pins PSK_Mod_0/out_bits] [get_bd_pins DAC_bits]
connect_bd_net [get_bd_pins PSK_Mod_0/out_vld] [get_bd_pins DAC_vld]
connect_bd_net [get_bd_pins TX_PHASE_CONFIG] [get_bd_pins dds_compiler_carrier/s_axis_config_tdata]
connect_bd_net -net proc_sys_reset_16M384_mb_reset [get_bd_pins rst_16M384] [get_bd_pins PSK_Mod_0/rst_16M384]
connect_bd_net -net s_axis_aclk_1 [get_bd_pins clk_1M024] [get_bd_pins axis_data_fifo_0/s_axis_aclk]
connect_bd_net -net s_axis_aresetn_1 [get_bd_pins rst_n_1M024] [get_bd_pins axis_data_fifo_0/s_axis_aresetn]
connect_bd_net [get_bd_pins xlconstant_one/dout] [get_bd_pins dds_compiler_carrier/s_axis_config_tvalid]

current_bd_instance /Const_Config
connect_bd_net -net DELAY_CNT_1 [get_bd_pins xlconstant_DELAY_CNT/dout] [get_bd_pins DELAY_CNT]
connect_bd_net [get_bd_pins xlconstant_FEEDBACK_SHIFT/dout] [get_bd_pins FEEDBACK_SHIFT]
connect_bd_net [get_bd_pins xlconstant_GARDNER_SHIFT/dout] [get_bd_pins GARDNER_SHIFT]
connect_bd_net [get_bd_pins xlconstant_MODE_CTRL/dout] [get_bd_pins MODE_CTRL]
connect_bd_net [get_bd_pins xlconstant_RX_BD_WINDOW/dout] [get_bd_pins RX_BD_WINDOW]
connect_bd_net [get_bd_pins xlconstant_RX_PD_WINDOW1/dout] [get_bd_pins RX_PD_WINDOW]
connect_bd_net [get_bd_pins xlconstant_RX_SD_THRESHOLD/dout] [get_bd_pins RX_SD_THRESHOLD]
connect_bd_net [get_bd_pins xlconstant_RX_SD_WINDOW/dout] [get_bd_pins RX_SD_WINDOW]
connect_bd_net [get_bd_pins xlconstant_TX_PHASE_CONFIG/dout] [get_bd_pins TX_PHASE_CONFIG]

current_bd_instance /
connect_bd_net -net AD9361_1RT_FDD_0_AD9361_FBCLK [get_bd_pins RF_Data_Converter/AD9361_FBCLK] [get_bd_ports AD9361_FBCLK]
connect_bd_net -net AD9361_1RT_FDD_0_AD9361_P1_D [get_bd_pins RF_Data_Converter/AD9361_P1_D] [get_bd_ports AD9361_P1_D]
connect_bd_net -net AD9361_1RT_FDD_0_AD9361_RX_CLK [get_bd_pins RF_Data_Converter/AD9361_RX_CLK] [get_bd_pins RF_Data_Converter/AD9361_TX_CLK]
connect_bd_net -net AD9361_1RT_FDD_0_AD9361_RX_DAT_I [get_bd_pins RF_Data_Converter/AD9361_RX_DAT_I] \
  [get_bd_pins Rx/ADC_I] [get_bd_pins system_ila_0/probe4]
connect_bd_net -net AD9361_1RT_FDD_0_AD9361_RX_DAT_Q [get_bd_pins RF_Data_Converter/AD9361_RX_DAT_Q] \
  [get_bd_pins Rx/ADC_Q] [get_bd_pins system_ila_0/probe5]
connect_bd_net -net AD9361_1RT_FDD_0_AD9361_TX_FRAME [get_bd_pins RF_Data_Converter/AD9361_TX_FRAME] [get_bd_ports AD9361_TX_FRAME]
connect_bd_net [get_bd_ports AD9361_DATACLK] [get_bd_pins RF_Data_Converter/AD9361_DATACLK]
connect_bd_net [get_bd_ports AD9361_P0_D] [get_bd_pins RF_Data_Converter/AD9361_P0_D]
connect_bd_net [get_bd_ports AD9361_RX_FRAME] [get_bd_pins RF_Data_Converter/AD9361_RX_FRAME]
connect_bd_net [get_bd_pins Clock_Gen/clk1M024] [get_bd_pins Tx/clk_1M024] [get_bd_pins Rx/clk_1M024]
connect_bd_net -net Clock_Gen_interconnect_aresetn [get_bd_pins Clock_Gen/rst_n_1M024] [get_bd_pins Tx/rst_n_1M024]
connect_bd_net [get_bd_pins Clock_Gen/rst_32M768] [get_bd_pins Rx/rst_32M768]
connect_bd_net [get_bd_pins Const_Config/RX_BD_WINDOW] [get_bd_pins Rx/RX_BD_WINDOW]
connect_bd_net [get_bd_pins Const_Config/RX_PD_WINDOW] [get_bd_pins Rx/RX_PD_WINDOW]
connect_bd_net [get_bd_pins Const_Config/RX_SD_THRESHOLD] [get_bd_pins Rx/RX_SD_THRESHOLD]
connect_bd_net [get_bd_pins Const_Config/TX_PHASE_CONFIG] [get_bd_pins Tx/TX_PHASE_CONFIG]
connect_bd_net -net DELAY_CNT_1 [get_bd_pins Const_Config/DELAY_CNT] [get_bd_pins Tx/DELAY_CNT]
connect_bd_net -net Div_clk32M768_0_clk16M384 [get_bd_pins Clock_Gen/clk_16M384] [get_bd_pins Rx/clk_16M384] [get_bd_pins Tx/clk_16M384]
connect_bd_net -net FEEDBACK_SHIFT_1 [get_bd_pins Const_Config/FEEDBACK_SHIFT] [get_bd_pins Rx/FEEDBACK_SHIFT]
connect_bd_net -net GARDNER_SHIFT_1 [get_bd_pins Const_Config/GARDNER_SHIFT] [get_bd_pins Rx/GARDNER_SHIFT]
connect_bd_net [get_bd_ports PL_CLK_100MHz] [get_bd_pins Clock_Gen/PL_CLK_100MHz]
connect_bd_net -net PSK_Mod_0_out_I [get_bd_pins Tx/DAC_I] [get_bd_pins system_ila_0/probe2] [get_bd_pins RF_Data_Converter/AD9361_TX_DAT_I]
connect_bd_net -net PSK_Mod_0_out_Q [get_bd_pins Tx/DAC_Q] [get_bd_pins system_ila_0/probe3] [get_bd_pins RF_Data_Converter/AD9361_TX_DAT_Q]
connect_bd_net -net RX_SD_WINDOW_1 [get_bd_pins Const_Config/RX_SD_WINDOW] [get_bd_pins Rx/RX_SD_WINDOW]
connect_bd_net [get_bd_pins Rx/BPSK] [get_bd_pins system_ila_0/probe13]
connect_bd_net [get_bd_pins Rx/I_16M] [get_bd_pins system_ila_0/probe6]
connect_bd_net [get_bd_pins Rx/I_1M] [get_bd_pins system_ila_0/probe10]
connect_bd_net [get_bd_pins Rx/NCO_cos] [get_bd_pins system_ila_0/probe8]
connect_bd_net [get_bd_pins Rx/QPSK] [get_bd_pins system_ila_0/probe12]
connect_bd_net [get_bd_pins Rx/QPSK_raw] [get_bd_pins system_ila_0/probe9]
connect_bd_net [get_bd_pins Rx/Q_16M] [get_bd_pins system_ila_0/probe7]
connect_bd_net [get_bd_pins Rx/Q_1M] [get_bd_pins system_ila_0/probe11]
connect_bd_net [get_bd_pins Rx/Rx_1bit] [get_bd_ports GPIO_TH2] [get_bd_pins system_ila_0/probe27]
connect_bd_net [get_bd_pins Rx/Rx_vld] [get_bd_pins system_ila_0/probe28]
connect_bd_net [get_bd_pins Rx/clk_1M_out] [get_bd_ports GPIO_TH4] [get_bd_pins system_ila_0/probe14]
connect_bd_net [get_bd_pins Rx/data_tdata] [get_bd_pins system_ila_0/probe19]
connect_bd_net [get_bd_pins Rx/data_tlast] [get_bd_pins system_ila_0/probe20]
connect_bd_net [get_bd_pins Rx/data_tuser] [get_bd_pins system_ila_0/probe21]
connect_bd_net [get_bd_pins Rx/data_tvalid] [get_bd_pins system_ila_0/probe22]
connect_bd_net [get_bd_pins Rx/error_tdata] [get_bd_pins system_ila_0/probe23]
connect_bd_net [get_bd_pins Rx/feedback_tdata] [get_bd_pins system_ila_0/probe24]
connect_bd_net [get_bd_pins Rx/gardner_error] [get_bd_pins system_ila_0/probe29]
connect_bd_net [get_bd_pins Rx/gardner_increment] [get_bd_pins system_ila_0/probe30]
connect_bd_net [get_bd_pins Tx/DAC_bits] [get_bd_pins system_ila_0/probe1]
connect_bd_net [get_bd_pins Tx/DAC_vld] [get_bd_pins system_ila_0/probe0]
connect_bd_net [get_bd_pins Tx/Tx_1bit] [get_bd_ports GPIO_TH1] [get_bd_pins system_ila_0/probe25]
connect_bd_net [get_bd_pins Tx/Tx_vld] [get_bd_pins system_ila_0/probe26]
connect_bd_net [get_bd_pins Tx/data_tdata] [get_bd_pins system_ila_0/probe15]
connect_bd_net [get_bd_pins Tx/data_tlast] [get_bd_pins system_ila_0/probe16]
connect_bd_net [get_bd_pins Tx/data_tuser] [get_bd_pins system_ila_0/probe17]
connect_bd_net [get_bd_pins Tx/data_tvalid] [get_bd_pins system_ila_0/probe18]
connect_bd_net -net clk_2M048_1 [get_bd_pins Clock_Gen/clk_2M048] [get_bd_pins Tx/clk_2M048] [get_bd_ports GPIO_TH3] [get_bd_pins Rx/clk_2M048]
connect_bd_net -net clk_32M768_1 [get_bd_pins Clock_Gen/clk_32M768] [get_bd_pins Rx/clk_32M768] [get_bd_pins system_ila_0/clk]
connect_bd_net -net clk_wiz_128M_clk_200M [get_bd_pins Clock_Gen/clk_200M] [get_bd_pins RF_Data_Converter/clk200M]
connect_bd_net -net proc_sys_reset_16M384_mb_reset [get_bd_pins Clock_Gen/rst_16M384] [get_bd_pins Rx/rst_16M384] [get_bd_pins Tx/rst_16M384]
connect_bd_net -net xlconstant_MODE_CTRL_dout [get_bd_pins Const_Config/MODE_CTRL] [get_bd_pins Rx/MODE_CTRL] [get_bd_pins Tx/MODE_CTRL]

validate_bd_design
save_bd_design
